# EAGLE design 612_jetracer_328_nodisplay (EAGLE 9.6.2)
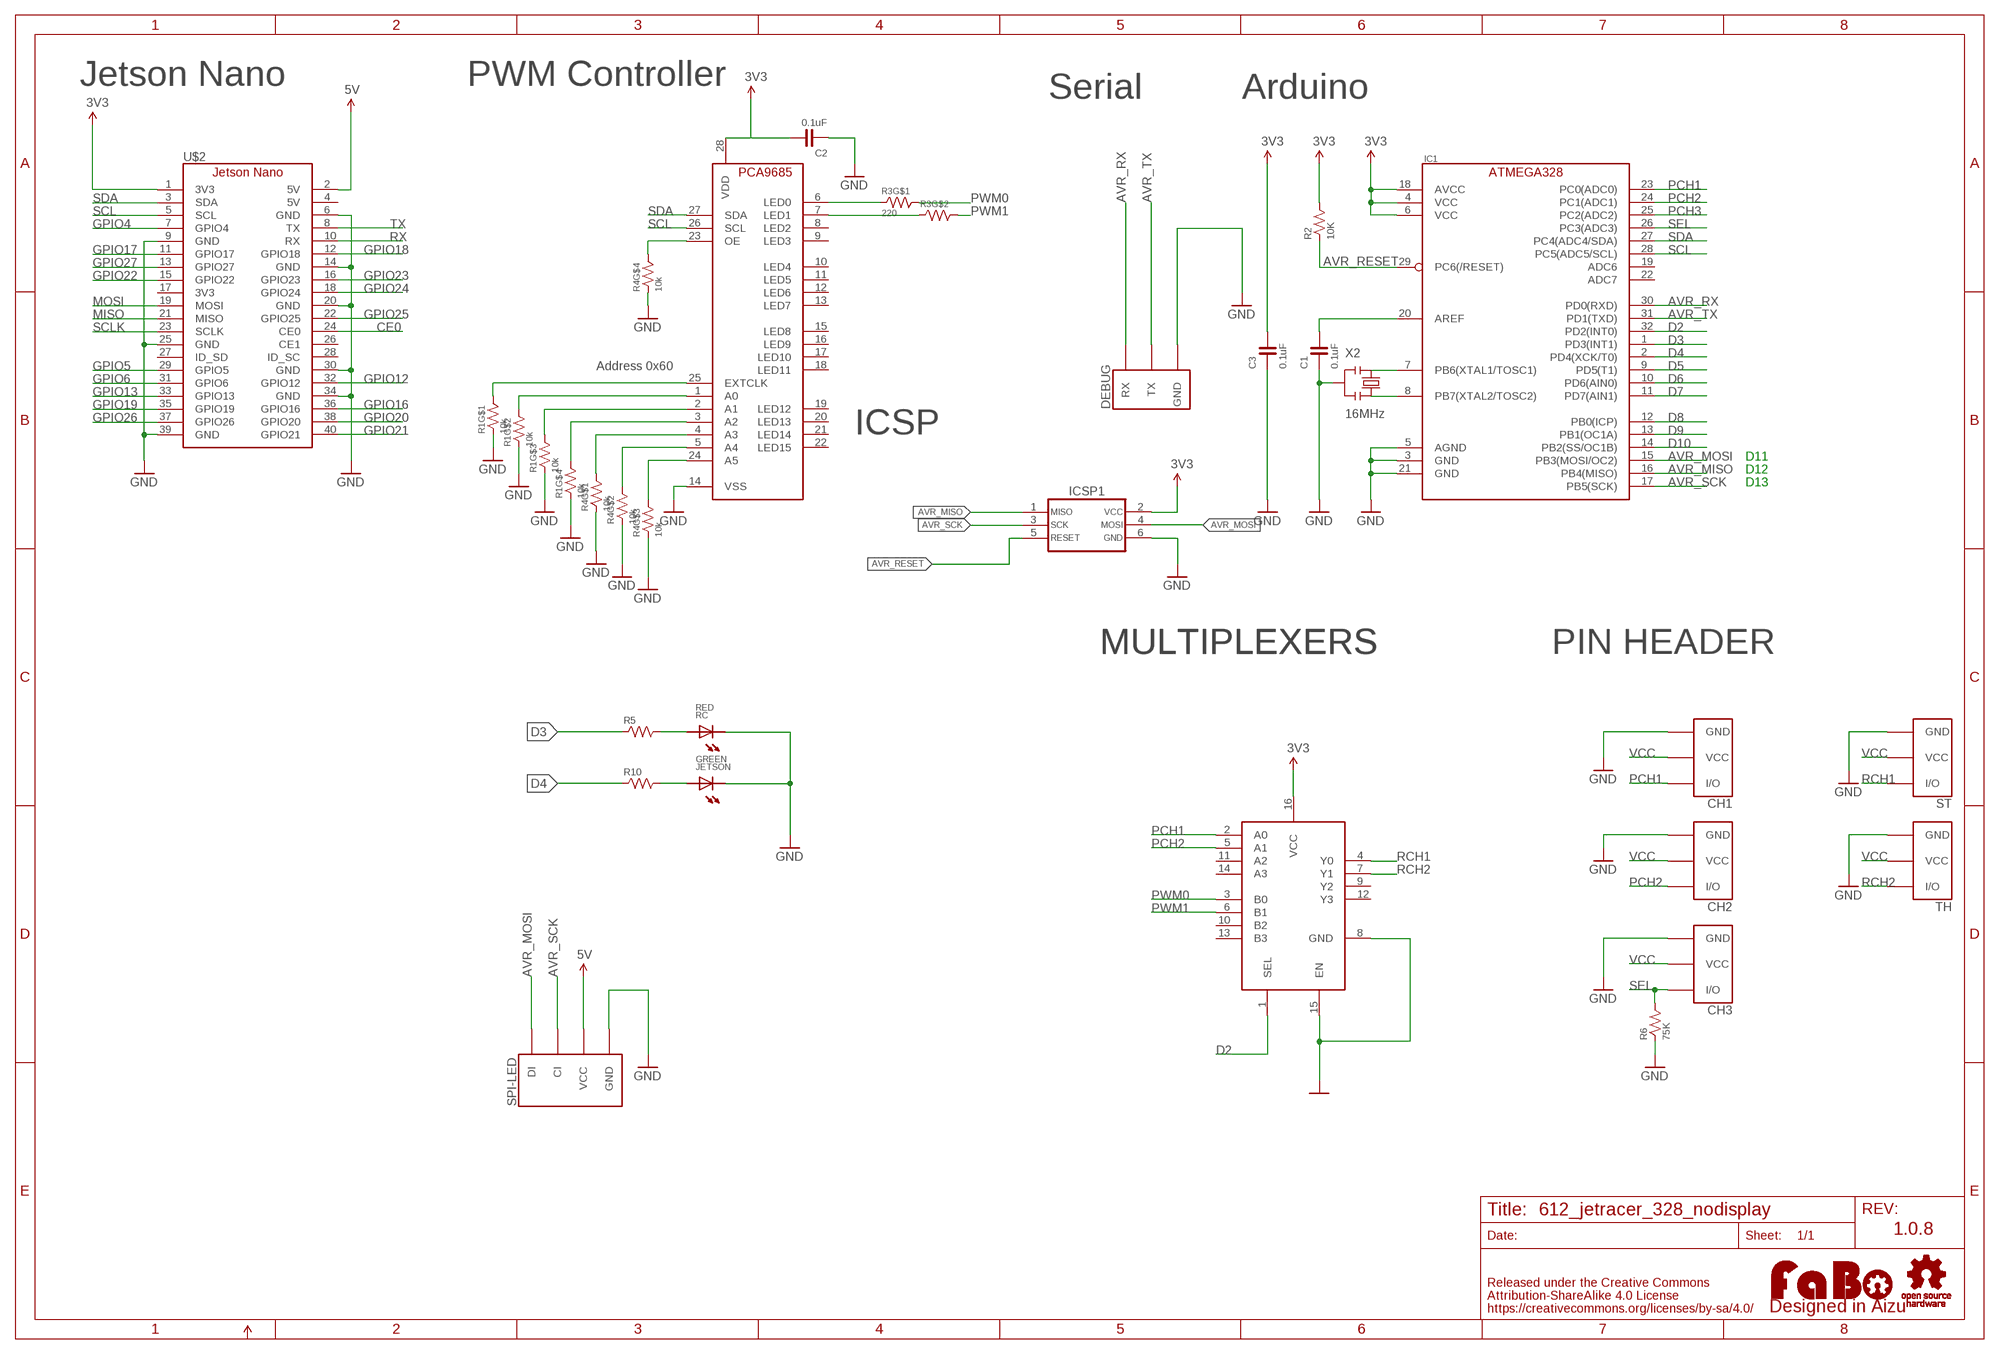
[diagram p0: schematic, sheet 1]

## Parts
C1  0.1uF  CAPACITOR-0603  [0603]
C2  0.1uF  CAPACITOR-0603  [0603]
C3  0.1uF  CAPACITOR-0603  [0603]
CH1  FABO_BRICK_3PIN-HEADER  [FABO_BRICK_3PIN_HEADER]
CH2  FABO_BRICK_3PIN-HEADER  [FABO_BRICK_3PIN_HEADER]
CH3  FABO_BRICK_3PIN-HEADER  [FABO_BRICK_3PIN_HEADER]
DEBUG  FABO_BRICK_3PIN_DEBUG  [FABO_BRICK_3PIN_DEBUG]
IC1  ATMEGA328P-AU  [TQFP-32]
IC3  MULTIPLEXERSMC74HC157A  [TSSOP-16]
ICSP1  ICSP_AVR-TC_NOHOLE  [TC2030]
JETSON  GREEN  LED-0603  [0603]
LOGO1  LOGO_FABO-S  [LOGO_FABO_S]
R1  10k  RESISTOR_ARRAY  [EXBV8V]
R2  10K  RESISTOR-0603  [0603]
R3  220  RESISTOR_ARRAY  [EXBV8V]
R4  10k  RESISTOR_ARRAY  [EXBV8V]
R5  10k  RESISTOR-0603  [0603]
R6  75K  RESISTOR-0603  [0603]
R10  10k  RESISTOR-0603  [0603]
RC  RED  LED-0603  [0603]
SPI-LED  FABO-SPI-LED-B04B  [SPI-B04B-PASK-1]
ST  FABO_BRICK_3PIN-HEADER  [FABO_BRICK_3PIN_HEADER]
TH  FABO_BRICK_3PIN-HEADER  [FABO_BRICK_3PIN_HEADER]
U$2  JETSON_NANO_NOBORDER  [JETSON_NANO_NOBOARDER]
U$3  PCA9685  [PCA9685]
U$5  LOGO_OSHW-M_BOTTOM  [LOGO_OSHW_M_BOTTOM]
X2  16MHz  RESONATOR  [CSTNE_V_C]

## Nets
3V3: C2.2 C3.2 IC1.4(VCC) IC1.6(VCC) IC1.18(AVCC) IC3.16(VCC) ICSP1.2 R2.2 U$2.1(3V3) U$3.28(VDD)
5V: SPI-LED.VCC U$2.2(5V)
AVR_MISO: IC1.16(PB4(MISO)) ICSP1.1
AVR_MOSI: IC1.15(PB3(MOSI/OC2)) ICSP1.4 SPI-LED.DI
AVR_RESET: IC1.29(PC6(/RESET)) ICSP1.5 R2.1
AVR_RX: DEBUG.RX IC1.30(PD0(RXD))
AVR_SCK: IC1.17(PB5(SCK)) ICSP1.3 SPI-LED.CI
AVR_TX: DEBUG.TX IC1.31(PD1(TXD))
CE0: U$2.24(CE0)
D2: IC1.32(PD2(INT0)) IC3.1(SEL)
D3: IC1.1(PD3(INT1)) R5.1
D4: IC1.2(PD4(XCK/T0)) R10.1
D5: IC1.9(PD5(T1))
D6: IC1.10(PD6(AIN0))
D7: IC1.11(PD7(AIN1))
D8: IC1.12(PB0(ICP))
D9: IC1.13(PB1(OC1A))
D10: IC1.14(PB2(SS/OC1B))
GND: C1.1 C2.1 C3.1 CH1.GND CH2.GND CH3.GND DEBUG.GND IC1.3(GND) IC1.5(AGND) IC1.21(GND) IC3.8(GND) IC3.15(EN) ICSP1.6 JETSON.CATHODE R1.1 R1.2 R1.3 R1.4 R4.1 R4.2 R4.3 R4.4 R6.1 RC.CATHODE SPI-LED.GND ST.GND TH.GND U$2.6(GND) U$2.9(GND) U$2.14(GND) U$2.20(GND) U$2.25(GND) U$2.30(GND) U$2.34(GND) U$2.39(GND) U$3.14(VSS) X2.2
GPIO4: U$2.7(GPIO4)
GPIO5: U$2.29(GPIO5)
GPIO6: U$2.31(GPIO6)
GPIO12: U$2.32(GPIO12)
GPIO13: U$2.33(GPIO13)
GPIO16: U$2.36(GPIO16)
GPIO17: U$2.11(GPIO17)
GPIO18: U$2.12(GPIO18)
GPIO19: U$2.35(GPIO19)
GPIO20: U$2.38(GPIO20)
GPIO21: U$2.40(GPIO21)
GPIO22: U$2.15(GPIO22)
GPIO23: U$2.16(GPIO23)
GPIO24: U$2.18(GPIO24)
GPIO25: U$2.22(GPIO25)
GPIO26: U$2.37(GPIO26)
GPIO27: U$2.13(GPIO27)
MISO: U$2.21(MISO)
MOSI: U$2.19(MOSI)
N$2: R3.1 U$3.6(LED0)
N$3: R3.2 U$3.7(LED1)
N$4: C1.2 IC1.20(AREF)
N$5: IC1.8(PB7(XTAL2/TOSC2)) X2.3
N$7: R4.5 U$3.23(OE)
N$8: R1.8 U$3.25(EXTCLK)
N$9: R1.7 U$3.1(A0)
N$10: R1.6 U$3.2(A1)
N$11: R1.5 U$3.3(A2)
N$12: R4.8 U$3.4(A3)
N$13: R4.7 U$3.5(A4)
N$14: R4.6 U$3.24(A5)
N$15: IC1.7(PB6(XTAL1/TOSC1)) X2.1
N$19: R5.2 RC.ANODE
N$20: JETSON.ANODE R10.2
PCH1: CH1.I/O IC1.23(PC0(ADC0)) IC3.2(A0)
PCH2: CH2.I/O IC1.24(PC1(ADC1)) IC3.5(A1)
PCH3: IC1.25(PC2(ADC2))
PWM0: IC3.3(B0) R3.8
PWM1: IC3.6(B1) R3.7
RCH1: IC3.4(Y0) ST.I/O
RCH2: IC3.7(Y1) TH.I/O
RX: U$2.10(RX)
SCL: IC1.28(PC5(ADC5/SCL)) U$2.5(SCL) U$3.26(SCL)
SCLK: U$2.23(SCLK)
SDA: IC1.27(PC4(ADC4/SDA)) U$2.3(SDA) U$3.27(SDA)
SEL: CH3.I/O IC1.26(PC3(ADC3)) R6.2
TX: U$2.8(TX)
VCC: CH1.VCC CH2.VCC CH3.VCC ST.VCC TH.VCC
Unconnected: IC1.19(ADC6) IC1.22(ADC7) IC3.9(Y2) IC3.10(B2) IC3.11(A2) IC3.12(Y3) IC3.13(B3) IC3.14(A3) R3.3 R3.4 R3.5 R3.6 U$2.4(5V) U$2.17(3V3) U$2.26(CE1) U$2.27(ID_SD) U$2.28(ID_SC) U$3.8(LED2) U$3.9(LED3) U$3.10(LED4) U$3.11(LED5) U$3.12(LED6) U$3.13(LED7) U$3.15(LED8) U$3.16(LED9) U$3.17(LED10) U$3.18(LED11) U$3.19(LED12) U$3.20(LED13) U$3.21(LED14) U$3.22(LED15)

## Notes on the sheet
- Jetson Nano | PWM Controller
- Serial | Arduino
- Address 0x60
- ICSP
- D11
- D12
- D13
- MULTIPLEXERS | MULTIPLEXERS | PIN HEADER
- 1.0.8

## Library data of the parts
C1-C3 = FaBo-Capacitor:CAPACITOR: CAPACITOR
CH1-CH3 ST TH = FaBo-Template:FABO_BRICK_3PIN: FaBo Brick 3pin
DEBUG = FaBo-Template:FABO_BRICK_3PIN_DEBUG
IC1 = component:ATMEGA328
IC3 = FaBo-Multiplexers:MULTIPLEXERS
ICSP1 = component:ICSP_AVR
JETSON RC = FaBo-LED:LED
LOGO1 = component:LOGO_FABO
R1 R3 R4 = component:RESISTOR_ARRAY
R2 R5 R6 R10 = FaBo-Resistors:RESISTOR: RESISTOR
SPI-LED = FaBo-Connetor:FABO-SPI-LED
U$2 = FaBo-Boards:JETSON_NANO
U$3 = FaBo-Motor:PCA9685
U$5 = FaBo-Logo:LOGO_OSHW
X2 = component:RESONATOR

## Board
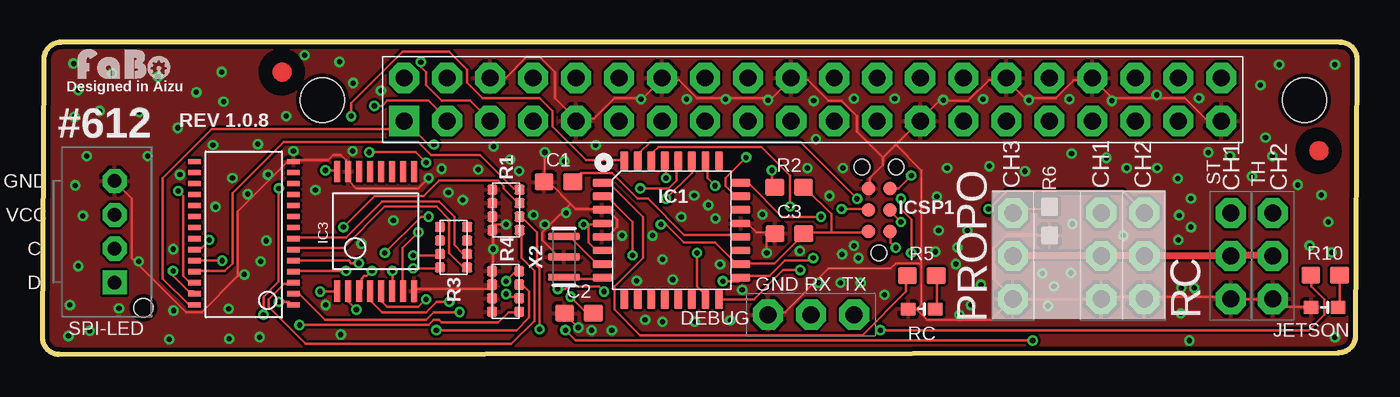
[diagram p1: board, top side]
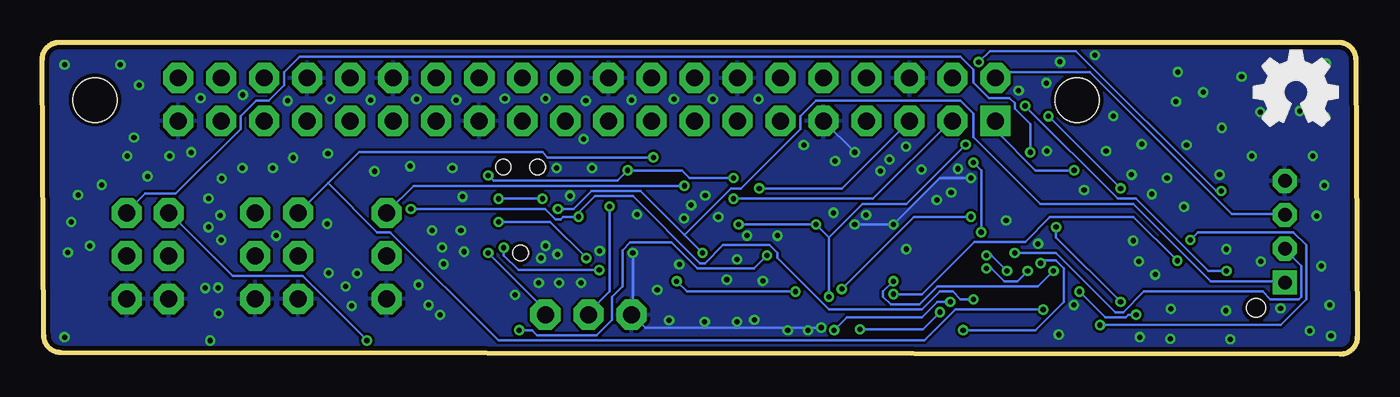
[diagram p2: board, bottom side, seen from below]

Size 77.63 x 18.43 mm. Coordinates in mm from the lower left corner, seen from the top.
Outline: 1,0 76.55,0.1 arc90 77.54,1.09 77.63,17.43 arc90 76.63,18.43 1.09,18.43 arc90 0.09,17.44 0,1 arc90 1,0
Copper layers (1*16): Top 0.035mm / dielectric 1.6mm / Bottom 0.035mm
Design rules "PCBway": minimum track width 6mil, minimum drill 12mil, track to track 6mil, track to pad 6mil, pad to pad 6mil, via to via 6mil, smd to smd 6mil, copper to edge 10mil, drill to drill 10mil, minimum pad ring 10mil, minimum via ring 6mil, stop-mask expansion 2mil, vias tented up to drill 100mil, thermal gap 8mil
Holes 2.6 mm at 16.54,15.02 74.52,15.02

### Footprints (pad centres in the part's own frame; a part is rotated, then mirrored left to right if it is on the bottom)
0603 = smd 1.1 x 1: 1 -0.85,0; 2 0.85,0
FABO_BRICK_3PIN_HEADER = drill 1 pad 1.778 octagon: GND -2.54,0; I/O 2.54,0; VCC 0,0
FABO_BRICK_3PIN_DEBUG = drill 1 pad 1.778 octagon: GND -2.54,0; RX 0,0; TX 2.54,0
TQFP-32 = smd 1.1 x 0.45: 1 -4.1,2.8; 2 -4.1,2; 3 -4.1,1.2; 4 -4.1,0.4; 5 -4.1,-0.4; 6 -4.1,-1.2; 7 -4.1,-2; 8 -4.1,-2.8; 17 4.1,-2.8; 18 4.1,-2; 19 4.1,-1.2; 20 4.1,-0.4; 21 4.1,0.4; 22 4.1,1.2; 23 4.1,2; 24 4.1,2.8 | smd 0.45 x 1.1: 9 -2.8,-4.1; 10 -2,-4.1; 11 -1.2,-4.1; 12 -0.4,-4.1; 13 0.4,-4.1; 14 1.2,-4.1; 15 2,-4.1; 16 2.8,-4.1; 25 2.8,4.1; 26 2,4.1; 27 1.2,4.1; 28 0.4,4.1; 29 -0.4,4.1; 30 -1.2,4.1; 31 -2,4.1; 32 -2.8,4.1
TSSOP-16 = smd 0.36 x 1.26: 1 -2.275,-3.53; 2 -1.625,-3.53; 3 -0.975,-3.53; 4 -0.325,-3.53; 5 0.325,-3.53; 6 0.975,-3.53; 7 1.625,-3.53; 8 2.275,-3.53; 9 2.275,3.53; 10 1.625,3.53; 11 0.975,3.53; 12 0.325,3.53; 13 -0.325,3.53; 14 -0.975,3.53; 15 -1.625,3.53; 16 -2.275,3.53
TC2030 = smd 0.787 x 0.787: 1 1.27,-0.635; 2 1.27,0.635; 3 2.54,-0.635; 4 2.54,0.635; 5 3.81,-0.635; 6 3.81,0.635 | hole 0.889: 0,0; 5.08,-1.016; 5.08,1.016
0603' = smd 0.9 x 0.8: ANODE -0.8,0; CATHODE 0.8,0
EXBV8V = smd 0.6 x 0.6: 1 -1.2,-0.8; 2 -0.4,-0.8; 3 0.4,-0.8; 4 1.2,-0.8; 5 1.2,0.8; 6 0.4,0.8; 7 -0.4,0.8; 8 -1.2,0.8
SPI-B04B-PASK-1 = drill 0.8 pad 1.422 octagon: CI 1,1.27; GND -3,1.27; VCC -1,1.27 | drill 0.8 pad 1.422 square: DI 3,1.27 | hole 1.1: 4.5,2.97
JETSON_NANO_NOBOARDER = drill 1 pad 1.778 square: 1 1.27,1.27 | drill 1 pad 1.778 octagon: 2 1.27,3.81; 3 3.81,1.27; 4 3.81,3.81; 5 6.35,1.27; 6 6.35,3.81; 7 8.89,1.27; 8 8.89,3.81; 9 11.43,1.27; 10 11.43,3.81; 11 13.97,1.27; 12 13.97,3.81; 13 16.51,1.27; 14 16.51,3.81; 15 19.05,1.27; 16 19.05,3.81; 17 21.59,1.27; 18 21.59,3.81; 19 24.13,1.27; 20 24.13,3.81; 21 26.67,1.27; 22 26.67,3.81; 23 29.21,1.27; 24 29.21,3.81; 25 31.75,1.27; 26 31.75,3.81; 27 34.29,1.27; 28 34.29,3.81; 29 36.83,1.27; 30 36.83,3.81; 31 39.37,1.27; 32 39.37,3.81; 33 41.91,1.27; 34 41.91,3.81; 35 44.45,1.27; 36 44.45,3.81; 37 46.99,1.27; 38 46.99,3.81; 39 49.53,1.27; 40 49.53,3.81
PCA9685 = smd 0.3 x 0.75: 1 -4.15,-2.93; 2 -3.5,-2.93; 3 -2.85,-2.93; 4 -2.2,-2.93; 5 -1.55,-2.93; 6 -0.9,-2.93; 7 -0.25,-2.93; 8 0.4,-2.93; 9 1.05,-2.93; 10 1.7,-2.93; 11 2.35,-2.93; 12 3,-2.93; 13 3.65,-2.93; 14 4.3,-2.93; 15 4.3,2.92; 16 3.65,2.92; 17 3,2.92; 18 2.35,2.92; 19 1.7,2.92; 20 1.05,2.92; 21 0.4,2.92; 22 -0.25,2.92; 23 -0.9,2.92; 24 -1.55,2.92; 25 -2.2,2.92; 26 -2.85,2.92; 27 -3.5,2.92; 28 -4.15,2.92
CSTNE_V_C = smd 0.4 x 1.9: 1 1.2,0; 2 0,0; 3 -1.2,0

### Placement (x,y rotation side)
C1  30.47,10.19 0 top
C2  31.68,2.43 0 top
C3  44.1,7.13 0 top
CH1  62.53,5.82 90 top
CH2  65.06,5.82 90 top
CH3  57.31,5.8 90 top
DEBUG  45.39,2.34 0 top
IC1  37.15,7.33 0 top
IC3  19.68,7.26 0 top
ICSP1  49.4,5.98 90 top
JETSON  GREEN  [0603']  75.71,2.77 180 top
LOGO1  4.87,16.12 0 top
R1  27.38,8.53 270 top
R2  44.09,9.88 0 top
R3  24.28,6.32 90 top
R4  27.35,3.71 270 top
R5  51.92,4.65 0 top
R6  59.48,7.87 90 top
R10  75.74,4.68 0 top
RC  RED  [0603']  51.92,2.67 180 top
SPI-LED  2.99,7.24 270 top
ST  70.18,5.8 90 top
TH  72.64,5.8 90 top
U$2  20.08,12.52 0 top
U$3  11.89,7.08 90 top
U$4  [MARK_POINT_3MM]  14.16,16.67 0 top
U$5  3.6,15.49 0 top
U$6  [MARK_POINT_3MM]  75.38,12.02 0 top
X2  30.79,5.75 90 top

### Tracks (layer width: path | path; a pad name or v marks a point on that pad's centre or on a via)
3V3  (via drill 0.3)
  Top 0.152: v31.19,3.4 32.1,2.48 32.41,2.48 C2.2 | 32.26,7.67 33.02,7.67 IC1.4 | 32.26,7.67 v31.95,7.67 | 32.26,7.67 32.26,6.6 32.71,6.14 33.02,6.14 IC1.6 | 46.58,7.21 45.06,7.21 C3.2 44.9,7.06 43.23,5.38 41.4,5.38 IC1.18 41.25,5.38 40.94,5.38 39.72,6.6 37.89,6.6 36.83,7.67 v36.52,7.67 | 46.58,7.21 48.71,7.21 ICSP1.2 | 46.58,7.21 46.58,8.27 45.06,9.8 R2.2 | U$3.28 8.94,2.94 8.63,2.94 7.11,4.46 7.11,10.41 10.01,13.3 20.83,13.3 21.28,13.76 U$2.1 21.44,13.76 22.81,12.39 v23.11,12.39 | v16.71,10.87 17.32,10.87 IC3.16
  Bottom 0.152: 31.19,6.9 v31.19,3.4 | 31.19,6.9 v31.95,7.67 v36.52,7.67 | v16.71,10.87 19,10.87 21.28,13.15 21.28,13.76 U$2.1 | 31.19,6.9 29.21,8.88 26.62,8.88 v23.11,12.39
5V
  Bottom 0.152: SPI-LED.VCC 4.37,8.27 7.41,8.27 15.8,16.66 20.98,16.66 21.28,16.35 U$2.2
AVR_MISO  (via drill 0.3)
  Top 0.152: v50.39,6.29 50.09,6.6 50.09,7.21 ICSP1.1 | v44.75,4.97 43.74,4.97 42.01,3.25 40.03,3.25 IC1.16
  Bottom 0.152: v50.39,6.29 50.39,5.84 49.53,4.97 v44.75,4.97
AVR_MOSI  (via drill 0.3)
  Top 0.152: v47.19,8.58 48.71,8.58 ICSP1.4 | v38.66,5.99 38.66,4.01 39.11,3.55 39.11,3.25 IC1.15
  Bottom 0.152: v47.19,8.58 46.28,8.58 45.21,9.65 42.31,9.65 39.72,7.06 | v38.66,5.99 39.72,7.06 | 39.72,7.06 36.98,9.8 36.37,9.8 32.87,13.3 32.87,14.07 31.95,14.98 23.42,14.98 22.65,14.22 22.65,12.85 18.69,8.88 13.21,8.88 8.63,4.31 4.37,4.31 SPI-LED.DI
AVR_RESET  (via drill 0.3)
  Top 0.152: v51.31,10.56 50.54,9.8 50.09,9.8 ICSP1.5 | v43.08,10.87 43.08,10.1 43.23,9.95 R2.1 | v36.83,10.41 36.83,11.32 IC1.29
  Bottom 0.152: v51.31,10.56 51,10.26 43.69,10.26 v43.08,10.87 39.88,10.87 39.42,10.41 v36.83,10.41
AVR_RX  (via drill 0.3)
  Top 0.152: v44.14,8.73 44.14,10.56 42.47,12.24 36.37,12.24 36.07,11.93 36.07,11.48 IC1.30
  Bottom 0.152: v44.14,8.73 44.14,3.7 45.36,2.48 DEBUG.RX
AVR_SCK  (via drill 0.3)
  Top 0.152: v50.7,7.82 50.09,8.43 ICSP1.3 | v45.51,5.68 45.36,5.53 43.84,5.53 42.92,4.62 41.4,4.62 IC1.17 41.25,4.46 41.09,4.31 v40.18,4.31 | v20.22,5.99 22.35,8.12 v22.81,8.12 | v30.43,3.86 30.88,3.86 31.04,4.01 32.87,4.01 v33.17,3.7
  Bottom 0.152: v50.7,7.82 47.65,7.82 v45.51,5.68 | v20.22,5.99 17.78,5.99 14.27,2.48 13.82,2.48 12.6,3.7 5.59,3.7 5.13,3.25 3.45,3.25 3.3,3.4 3.3,5.23 4.21,6.14 SPI-LED.CI | v22.81,8.12 26.16,8.12 v30.43,3.86 | v33.17,3.7 39.57,3.7 v40.18,4.31
AVR_TX  (via drill 0.3)
  Top 0.152: v48.11,9.19 44.75,12.54 35.91,12.54 35.3,11.93 35.3,11.48 IC1.31 | v50.7,9.19 50.7,8.58 51.31,7.97 v51.31,5.99
  Bottom 0.152: v50.7,9.19 v48.11,9.19 | v51.31,5.99 47.8,2.48 DEBUG.TX
D2  (via drill 0.3)
  Top 0.152: v18.23,14.07 18.23,14.83 21.28,17.88 24.03,17.88 25.09,16.81 25.09,16.05 26.01,15.13 29.36,15.13 30.12,14.37 30.12,13.46 32.1,11.48 34.24,11.48 IC1.32 | v13.97,9.8 13.97,4.31 13.05,3.4 v13.05,2.33 | v16.41,3.7 17.32,3.7 IC3.1
  Bottom 0.152: v13.97,9.8 v18.23,14.07 | v13.05,2.33 13.51,2.33 13.66,2.18 14.88,2.18 v16.41,3.7
D3
  Top 0.152: R5.1 51,4.62 51,3.7 48.41,1.11 35.3,1.11 33.78,2.64 33.78,4.01 35.46,5.68 35.46,8.12 33.47,10.1 33.17,10.1 IC1.1
D4  (via drill 0.3)
  Top 0.152: v49.48,1.42 74.78,1.42 75.69,2.33 75.69,3.25 74.93,4.01 74.93,4.62 R10.1 | v34.85,5.84 34.85,7.82 33.47,9.19 33.17,9.19 IC1.2
  Bottom 0.152: v49.48,1.42 48.71,1.42 48.41,1.11 44.9,1.11 43.99,2.03 43.99,3.4 43.38,4.01 43.38,6.14 42.92,6.6 40.49,6.6 38.96,5.07 35.61,5.07 v34.85,5.84
GND  (via drill 0.3)
  Top 0.152: SPI-LED.GND 4.37,10.1 5.28,9.19 5.28,5.68 8.48,2.48 9.4,2.48 11.53,4.62 11.53,8.43 14.42,11.32 14.73,11.32 U$3.14 14.88,11.48 16.86,11.48 17.17,11.78 17.63,11.78 17.93,11.48 17.93,10.87 IC3.15 18.08,10.71 18.08,10.26 18.54,9.8 22.2,9.8 v22.81,10.41 | 26.62,7.67 26.62,8.12 R1.3 26.62,8.27 26.62,8.88 R1.2 26.62,9.04 26.62,9.65 R1.1 | 26.62,7.67 26.62,7.36 R1.4 26.62,7.21 26.62,4.92 R4.1 26.62,4.77 26.62,4.16 R4.2 | R4.4 26.62,2.64 26.62,3.25 R4.3 26.62,3.4 26.62,3.86 | 26.62,3.86 26.62,4.01 R4.2 | 26.62,3.86 22.04,3.86 IC3.8 | 26.62,3.86 R4.2 | IC1.5 33.17,7.06 33.47,7.06 33.93,7.51 33.93,7.97 33.47,8.43 33.17,8.43 IC1.3 33.02,8.58 31.49,8.58 31.19,8.88 | 31.19,8.88 29.97,10.1 29.66,10.1 C1.1 29.66,10.26 v29.66,11.93 | 31.19,8.88 29.82,7.51 | 29.82,7.51 29.51,7.21 29.51,6.75 30.43,5.84 30.73,5.84 X2.2 | U$2.6 26.46,16.35 27.38,16.35 28.6,17.57 29.36,17.57 30.27,16.66 30.27,15.13 31.49,13.91 U$2.9 31.65,13.91 32.56,13.91 33.78,15.13 35.46,15.13 36.52,16.2 U$2.14 36.68,16.2 37.59,16.2 38.66,15.13 43.08,15.13 44.14,16.2 U$2.20 44.3,16.2 45.21,16.2 46.43,14.98 47.19,14.98 48.11,14.07 48.11,13.15 49.63,11.63 | v27.38,7.67 26.62,7.67 | 29.82,7.51 v29.66,7.67 | 49.63,11.63 49.63,11.17 48.87,10.41 48.87,9.8 ICSP1.6 | 50.39,12.39 51.76,13.76 U$2.25 51.92,13.91 52.98,14.98 54.66,14.98 55.88,16.2 56.79,16.2 U$2.30 56.94,16.2 58.01,15.13 59.84,15.13 60.91,16.2 61.97,16.2 U$2.34 62.13,16.2 63.19,15.13 67.46,15.13 68.68,13.91 69.59,13.91 U$2.39 | 50.39,12.39 49.63,11.63 | 42.77,7.21 42.16,7.21 41.7,7.67 41.4,7.67 IC1.21 | 42.77,7.21 43.23,7.21 C3.1 42.77,7.21
  Top 0.152: v31.65,1.57 30.88,2.33 C2.1 | v42.77,5.99 42.77,7.21 | 51.61,2.64 51.15,2.64 RC.CATHODE | 51.61,2.64 52.22,2.03 56.03,2.03 57.25,3.25 CH3.GND | R6.1 59.38,7.06 56.94,7.06 56.18,6.29 56.18,4.46 57.25,3.4 CH3.GND | JETSON.CATHODE 74.78,2.79 73.25,2.79 72.79,3.25 TH.GND 72.64,3.25 70.2,3.25 ST.GND 70.05,3.4 65.17,3.4 CH2.GND 65.02,3.4 62.58,3.4 CH1.GND 62.43,3.25 57.4,3.25 CH3.GND | 51.92,5.23 51.76,5.38 50.39,5.38 50.09,5.07 46.43,5.07 43.84,2.48 42.92,2.48 DEBUG.GND | 51.92,5.23 51.92,2.94 51.61,2.64 | 50.39,12.39 51.92,10.87 51.92,5.23
  Bottom 0.152: v29.66,11.93 31.49,13.76 U$2.9 | v29.66,7.67 v27.38,7.67 24.64,10.41 v22.81,10.41 | v31.65,1.57 42.01,1.57 42.77,2.33 DEBUG.GND 42.77,2.48 v42.77,5.99
  other vias: 11.22,10.41 7.99,13.38 12.89,5.48 5.69,5.48 10.99,2.68 2.79,1.38 2.39,8.18 3.39,14.38 9.09,15.48 10.59,16.68 13.32,10.61 16.12,9.71 12.72,12.41 13.22,6.71 11.92,4.71 20.72,7.91 25.72,10.91 27.62,11.51 24.82,9.11 26.62,6.21 33.62,1.41 32.42,1.41 36.62,1.91 38.52,1.91 37.22,4.41 36.62,5.61 37.72,8.11 39.32,8.81 36.02,7.01 34.22,7.01 47.12,4.21 45.82,4.21 48.32,4.21 47.22,5.91 49.72,3.51 54.82,2.91 59.72,4.01 68.02,3.91 67.72,0.81 14.39,14.08 40.02,5.31 53.42,11.01 52.82,9.31 52.92,7.31 54.62,7.31 75.92,7.81 67.12,8.21 71.42,10.51 74.12,10.01 75.52,9.41 74.82,6.41 76.12,6.01 67.22,2.41 67.82,9.21 65.82,11.01 72.22,12.81 71.92,15.91 62.82,11.61 64.02,11.01 58.02,10.81 55.92,11.11 60.82,7.71 54.02,6.31 41.32,3.81 12.82,1.01 11.02,0.91 10.22,8.71 7.72,6.21 8.12,10.61 6.22,11.71 2.62,11.71 2.12,5.21 1.62,2.91 4.52,2.71 5.72,14.31 6.82,16.41 4.12,16.61 2.12,15.61 60.72,4.81 70.12,11.71 76.32,17.11 73.02,17.11 76.32,1.01 63.82,7.01 55.42,4.11 50.32,15.11 47.92,15.11 40.62,2.01 17.62,1.16 16.72,2.91 23.97,9.56 23.57,10.96 30.92,8.36 30.82,11.41 32.67,12.36 42.52,8.26 44.72,6.11 47.92,6.41 52.72,6.06 59.37,2.86 67.82,7.51 67.07,6.76 60.77,11.86 72.62,11.71 45.67,12.71 47.27,11.01 45.17,11.01 46.47,9.36 7.74,2.58 7.49,0.88 1.54,1.08 1.94,9.98 1.89,14.03 1.84,17.18 10.69,14.93 35.34,15.08 38.04,15.08 40.34,15.08 42.84,15.03 45.54,14.98 53.19,15.03 55.54,15.08 58.24,15.03 60.64,15.08 63.14,14.98 65.79,15.33 68.29,15.13 67.04,10.38 68.84,11.93 67.24,3.93 59.04,4.78 54.14,2.33 53.94,5.33 48.19,5.68 38.49,9.38 39.74,8.03 35.09,4.33 35.59,2.03 28.99,8.23 28.14,10.83 26.64,12.28 18.84,6.53 12.12,9.46 10.07,12.36 14.82,12.01 18.32,12.01 15.49,17.68 17.54,17.28 18.34,16.03 19.99,15.58
  pour Bottom: -0.21,-1.02 78.53,-1.02 78.53,1.52 78.53,19.3 -0.21,19.3
  pour Top: -0.21,-1.02 78.53,-1.02 78.53,0.25 78.53,19.3 -0.21,19.3
N$2
  Top 0.152: R3.1 24.94,5.23 24.79,5.23 24.03,5.99 24.03,7.97 23.26,8.73 20.22,8.73 17.78,6.29 14.88,6.29 U$3.6
N$3
  Top 0.152: R3.2 24.94,5.99 24.79,5.99 24.33,6.45 24.33,8.12 23.42,9.04 20.06,9.04 17.93,6.9 14.88,6.9 U$3.7
N$4
  Top 0.152: IC1.20 41.25,7.06 37.89,7.06 35.76,9.19 35.15,9.19 33.63,10.71 31.8,10.71 31.34,10.26 C1.2
N$5
  Top 0.152: IC1.8 33.02,4.46 30.88,4.46 X2.3
N$7  (via drill 0.3)
  Top 0.152: v15.19,1.72 22.81,1.72 23.11,2.03 23.42,2.03 23.57,1.87 26.92,1.87 27.53,2.48 28.14,2.48 R4.5 | v9.85,6.75 9.4,6.29 9.09,6.29 U$3.23
  Bottom 0.152: v15.19,1.72 4.52,1.72 2.99,3.25 2.99,6.45 3.76,7.21 9.4,7.21 v9.85,6.75
N$8
  Top 0.152: R1.8 28.14,9.8 27.84,9.8 25.85,11.78 22.96,11.78 22.2,12.54 14.23,12.54 11.22,9.53 11.22,5.38 10.77,4.92 9.09,4.92 U$3.25
N$9  (via drill 0.3)
  Top 0.152: v17.78,7.51 19.61,9.34 22.5,9.34 23.42,10.26 26.92,10.26 27.23,9.95 27.23,9.8 27.99,9.04 28.14,9.04 R1.7 | v13.97,3.09 14.58,3.09 14.73,2.94 U$3.1
  Bottom 0.152: v17.78,7.51 17.78,6.9 v13.97,3.09
N$10  (via drill 0.3)
  Top 0.152: v29.36,1.47 29.36,5.07 29.21,5.23 29.21,7.21 28.29,8.12 R1.6 | v24.64,2.48 23.11,2.48 22.65,2.03 16.71,2.03 15.19,3.55 14.88,3.55 U$3.2
  Bottom 0.152: v29.36,1.47 25.65,1.47 v24.64,2.48
N$11
  Top 0.152: R1.5 28.29,7.21 28.29,5.68 29.06,4.92 29.06,1.98 27.69,0.61 15.54,0.61 13.36,2.79 13.36,3.25 14.27,4.16 14.73,4.16 U$3.3
N$12  (via drill 0.3)
  Top 0.152: v27.38,4.31 27.84,4.77 28.14,4.77 R4.8 | v17.93,4.92 14.88,4.92 U$3.4
  Bottom 0.152: v27.38,4.31 27.99,3.7 27.99,3.4 27.53,2.94 25.85,2.94 24.79,4.01 18.84,4.01 v17.93,4.92
N$13  (via drill 0.3)
  Top 0.152: v23.26,1.42 27.99,1.42 28.75,2.18 28.75,3.7 28.45,4.01 28.29,4.01 R4.7 | v18.69,5.38 18.23,5.38 18.08,5.53 14.88,5.53 U$3.5
  Bottom 0.152: v23.26,1.42 19,1.42 17.32,3.09 17.32,5.07 17.78,5.53 18.54,5.53 v18.69,5.38
N$14  (via drill 0.3)
  Top 0.152: v27.38,3.55 27.53,3.4 28.14,3.4 R4.6 | v10.61,5.53 9.09,5.53 U$3.24
  Bottom 0.152: v27.38,3.55 25.7,3.55 22.6,6.65 19.6,6.65 18.13,8.12 13.21,8.12 v10.61,5.53
N$15
  Top 0.152: IC1.7 33.02,5.38 32.71,5.38 31.19,6.9 30.88,6.9 X2.1
N$19
  Top 0.152: RC.ANODE 52.83,2.79 52.83,4.62 R5.2
N$20
  Top 0.152: JETSON.ANODE 76.6,2.79 76.6,4.62 R10.2
PCH1  (via drill 0.3)
  Top 0.152: v41.55,11.63 40.33,10.41 40.33,9.95 40.94,9.34 41.25,9.34 IC1.23 | v18.54,2.64 18.08,3.09 18.08,3.7 IC3.2
  Bottom 0.152: v41.55,11.63 47.8,11.63 48.11,11.93 58.93,11.93 60.75,10.1 | 60.75,10.1 62.43,8.43 CH1.I/O | v18.54,2.64 23.72,2.64 25.55,0.81 50.7,0.81 57.1,7.21 57.86,7.21 60.75,10.1
PCH2  (via drill 0.3)
  Top 0.152: v45.97,8.12 43.69,8.12 41.7,10.1 41.4,10.1 IC1.24 | v55.88,8.58 56.94,9.65 63.8,9.65 65.02,8.43 CH2.I/O | v22.65,3.25 22.2,2.79 20.37,2.79 20.06,3.09 20.06,3.7 IC3.5
  Bottom 0.152: v55.88,8.58 47.95,8.58 47.34,7.97 47.04,7.97 46.89,8.12 v45.97,8.12 45.97,8.37 45,9.34 42.77,9.34 38.81,5.38 38.5,5.38 37.44,6.45 34.69,6.45 34.24,5.99 34.24,5.68 31.19,2.64 25.7,2.64 24.64,3.7 23.87,3.7 23.42,3.25 v22.65,3.25
PWM0  (via drill 0.3)
  Top 0.152: v21.89,5.07 23.42,5.07 R3.8 | v19.45,4.92 19.15,4.62 19,4.62 18.84,4.46 18.84,3.86 IC3.3
  Bottom 0.152: v21.89,5.07 21.59,5.07 20.83,4.31 20.06,4.31 v19.45,4.92
PWM1  (via drill 0.3)
  Top 0.152: v21.89,5.84 23.42,5.84 R3.7 | v20.67,4.92 20.67,3.86 IC3.6
  Bottom 0.152: v21.89,5.84 21.59,5.84 v20.67,4.92
RCH1  (via drill 0.3)
  Top 0.152: v24.03,3.09 23.26,3.09 22.65,2.48 20.06,2.48 19.45,3.09 19.45,3.7 IC3.4 | v30.88,1.42 31.49,0.81 v58.47,0.81
  Bottom 0.152: v24.03,3.09 24.79,3.09 25.7,2.18 30.12,2.18 v30.88,1.42 | v58.47,0.81 62.28,4.62 66.39,4.62 70.05,8.27 ST.I/O
RCH2  (via drill 0.3)
  Top 0.152: v22.2,7.21 21.28,6.29 21.28,3.86 IC3.7 | v22.65,11.32 22.04,11.93 v19.3,11.93
  Bottom 0.152: v22.2,7.21 22.2,10.87 v22.65,11.32 | v19.3,11.93 19.3,13.61 20.22,14.52 20.22,14.83 20.52,15.13 21.74,15.13 22.65,16.05 22.65,16.81 23.42,17.57 62.43,17.57 63.35,16.66 63.35,15.89 64.26,14.98 65.02,14.98 65.94,14.07 65.94,13.3 69.75,9.49 71.57,9.49 72.64,8.43 TH.I/O
SCL  (via drill 0.3)
  Top 0.152: v8.02,9.65 8.33,9.34 8.33,4.62 8.63,4.31 8.94,4.31 U$3.26 | v22.35,17.27 22.35,16.96 22.65,16.66 22.65,15.89 23.57,14.98 25.25,14.98 26.31,13.91 U$2.5 | v35.3,9.8 36.98,9.8 37.44,10.26 37.44,11.32 IC1.28
  Bottom 0.152: v8.02,9.65 8.33,9.65 16.6,17.92 21.69,17.92 v22.35,17.27 | v35.3,9.8 30.43,9.8 26.46,13.76 U$2.5
SDA  (via drill 0.3)
  Top 0.152: v7.72,4.92 7.72,4.62 8.63,3.7 8.94,3.7 U$3.27 | v19.61,14.68 20.06,14.68 20.37,14.98 22.81,14.98 23.87,13.91 U$2.3 | v36.83,9.19 38.35,10.71 38.35,11.32 IC1.27
  Bottom 0.152: v7.72,4.92 8.79,4.92 13.05,9.19 14.12,9.19 v19.61,14.68 | v36.83,9.19 28.6,9.19 24.03,13.76 U$2.3
SEL  (via drill 0.3)
  Top 0.152: v39.72,9.95 39.27,10.41 39.27,11.32 IC1.26 | R6.2 59.38,8.58 57.55,8.58 57.4,8.43 CH3.I/O
  Bottom 0.152: v39.72,9.95 55.73,9.95 57.25,8.43 CH3.I/O
VCC
  Top 0.152: 70.2,5.84 ST.VCC 70.05,5.84 | 72.64,5.84 TH.VCC | 57.4,5.84 CH3.VCC | 62.43,5.84 CH1.VCC 62.58,5.84 | 65.02,5.84 CH2.VCC 65.17,5.84
  Top 0.406: 72.64,5.84 70.2,5.84 | 62.43,5.84 57.4,5.84 | 62.58,5.84 65.02,5.84 | 65.17,5.84 70.05,5.84

### Text on the board
tPlace: Designed in Aizu | REV 1.0.8 | #612 | CH1 | CH2 | GND | RX | TX | PROPO | RC